# Altium schematic sheet BMD_RevB_B5_AMP.SchDoc: MPPC
size 401 x 291 mm; DocumentNumber: 2; SheetNumber: 5; SheetTotal: 6
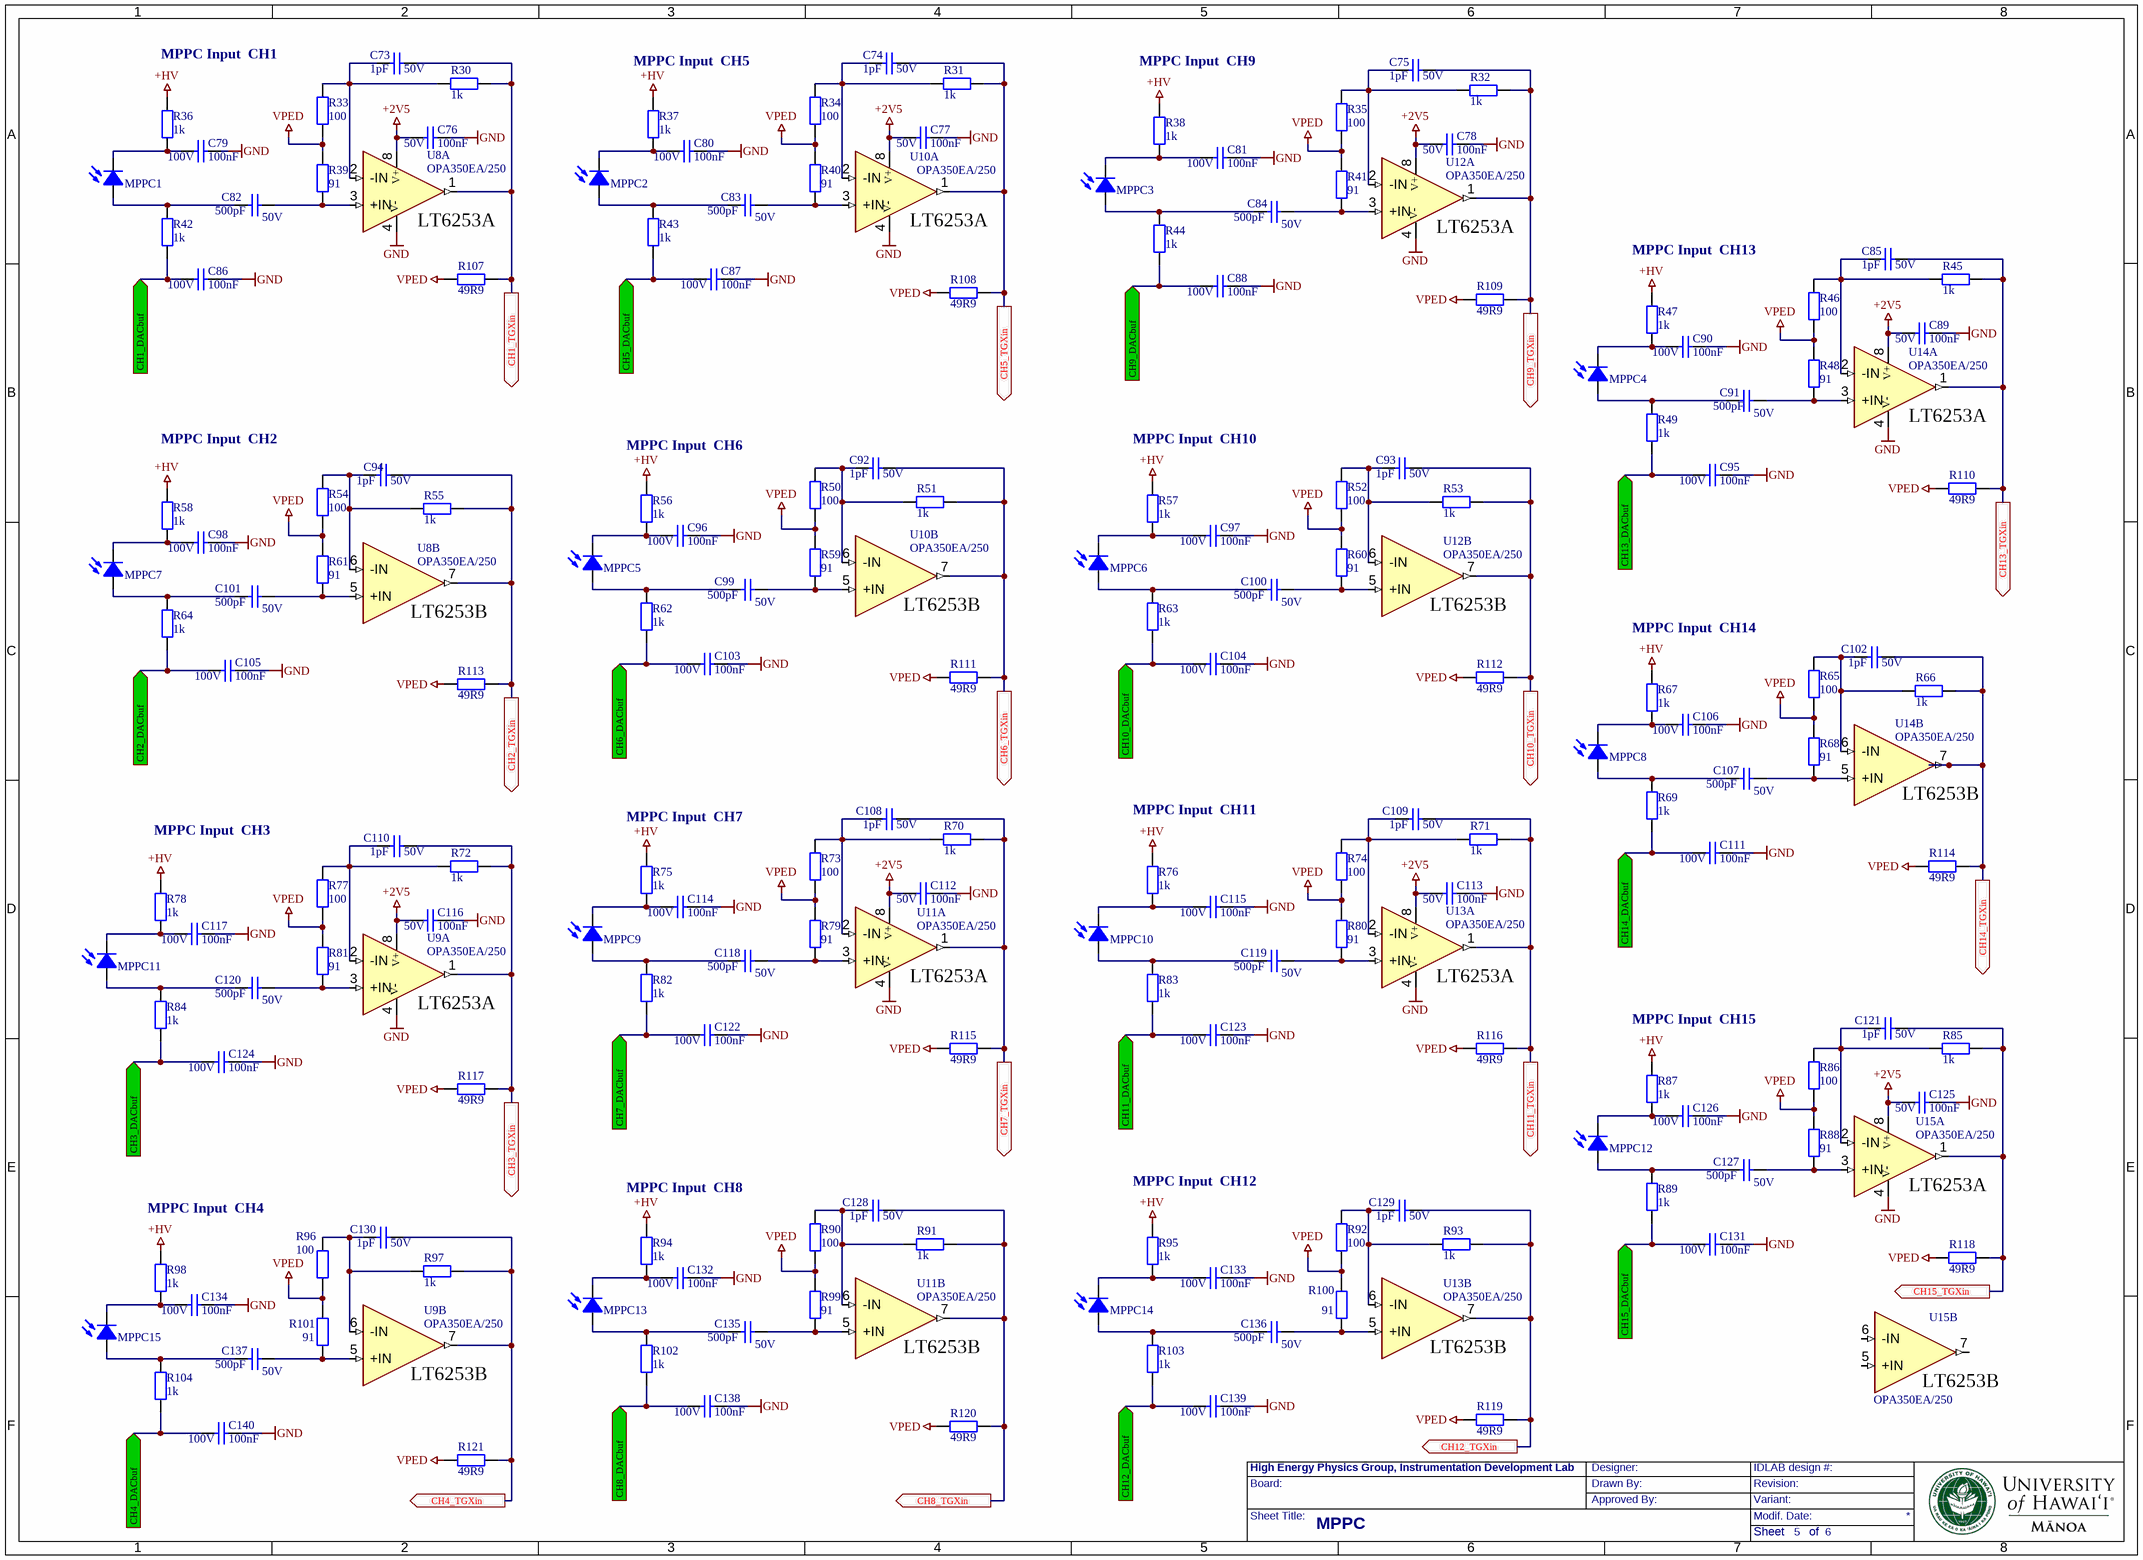
[diagram p0: BMD_RevB_B5_AMP.SchDoc]

## Parts
C73  1pF  Voltage rating: 50V  [CC0603RF1R]
C74  1pF  Voltage rating: 50V  [CC0603RF1R]
C75  1pF  Voltage rating: 50V  [CC0603RF1R]
C76  100nF  Voltage rating: 50V  [CC0402N1R]
C77  100nF  Voltage rating: 50V  [CC0402N1R]
C78  100nF  Voltage rating: 50V  [CC0402N1R]
C79  100nF  Voltage rating: 100V  [RC0603N1R]
C80  100nF  Voltage rating: 100V  [RC0603N1R]
C81  100nF  Voltage rating: 100V  [RC0603N1R]
C82  500pF  Voltage rating: 50V  [CC0603RF1R]
C83  500pF  Voltage rating: 50V  [CC0603RF1R]
C84  500pF  Voltage rating: 50V  [CC0603RF1R]
C85  1pF  Voltage rating: 50V  [CC0603RF1R]
C86  100nF  Voltage rating: 100V  [RC0603N1R]
C87  100nF  Voltage rating: 100V  [RC0603N1R]
C88  100nF  Voltage rating: 100V  [RC0603N1R]
C89  100nF  Voltage rating: 50V  [CC0402N1R]
C90  100nF  Voltage rating: 100V  [RC0603N1R]
C91  500pF  Voltage rating: 50V  [CC0603RF1R]
C92  1pF  Voltage rating: 50V  [CC0603RF1R]
C93  1pF  Voltage rating: 50V  [CC0603RF1R]
C94  1pF  Voltage rating: 50V  [CC0603RF1R]
C95  100nF  Voltage rating: 100V  [RC0603N1R]
C96  100nF  Voltage rating: 100V  [RC0603N1R]
C97  100nF  Voltage rating: 100V  [RC0603N1R]
C98  100nF  Voltage rating: 100V  [RC0603N1R]
C99  500pF  Voltage rating: 50V  [CC0603RF1R]
C100  500pF  Voltage rating: 50V  [CC0603RF1R]
C101  500pF  Voltage rating: 50V  [CC0603RF1R]
C102  1pF  Voltage rating: 50V  [CC0603RF1R]
C103  100nF  Voltage rating: 100V  [RC0603N1R]
C104  100nF  Voltage rating: 100V  [RC0603N1R]
C105  100nF  Voltage rating: 100V  [RC0603N1R]
C106  100nF  Voltage rating: 100V  [RC0603N1R]
C107  500pF  Voltage rating: 50V  [CC0603RF1R]
C108  1pF  Voltage rating: 50V  [CC0603RF1R]
C109  1pF  Voltage rating: 50V  [CC0603RF1R]
C110  1pF  Voltage rating: 50V  [CC0603RF1R]
C111  100nF  Voltage rating: 100V  [RC0603N1R]
C112  100nF  Voltage rating: 50V  [CC0402N1R]
C113  100nF  Voltage rating: 50V  [CC0402N1R]
C114  100nF  Voltage rating: 100V  [RC0603N1R]
C115  100nF  Voltage rating: 100V  [RC0603N1R]
C116  100nF  Voltage rating: 50V  [CC0402N1R]
C117  100nF  Voltage rating: 100V  [RC0603N1R]
C118  500pF  Voltage rating: 50V  [CC0603RF1R]
C119  500pF  Voltage rating: 50V  [CC0603RF1R]
C120  500pF  Voltage rating: 50V  [CC0603RF1R]
C121  1pF  Voltage rating: 50V  [CC0603RF1R]
C122  100nF  Voltage rating: 100V  [RC0603N1R]
C123  100nF  Voltage rating: 100V  [RC0603N1R]
C124  100nF  Voltage rating: 100V  [RC0603N1R]
C125  100nF  Voltage rating: 50V  [CC0402N1R]
C126  100nF  Voltage rating: 100V  [RC0603N1R]
C127  500pF  Voltage rating: 50V  [CC0603RF1R]
C128  1pF  Voltage rating: 50V  [CC0603RF1R]
C129  1pF  Voltage rating: 50V  [CC0603RF1R]
C130  1pF  Voltage rating: 50V  [CC0603RF1R]
C131  100nF  Voltage rating: 100V  [RC0603N1R]
C132  100nF  Voltage rating: 100V  [RC0603N1R]
C133  100nF  Voltage rating: 100V  [RC0603N1R]
C134  100nF  Voltage rating: 100V  [RC0603N1R]
C135  500pF  Voltage rating: 50V  [CC0603RF1R]
C136  500pF  Voltage rating: 50V  [CC0603RF1R]
C137  500pF  Voltage rating: 50V  [CC0603RF1R]
C138  100nF  Voltage rating: 100V  [RC0603N1R]
C139  100nF  Voltage rating: 100V  [RC0603N1R]
C140  100nF  Voltage rating: 100V  [RC0603N1R]
MPPC1  MPPC  [MPPC S12572-050P]  (value not drawn)
MPPC2  MPPC  [MPPC S12572-050P]  (value not drawn)
MPPC3  MPPC  [MPPC S12572-050P]  (value not drawn)
MPPC4  MPPC  [MPPC S12572-050P]  (value not drawn)
MPPC5  MPPC  [MPPC S12572-050P]  (value not drawn)
MPPC6  MPPC  [MPPC S12572-050P]  (value not drawn)
MPPC7  MPPC  [MPPC S12572-050P]  (value not drawn)
MPPC8  MPPC  [MPPC S12572-050P]  (value not drawn)
MPPC9  MPPC  [MPPC S12572-050P]  (value not drawn)
MPPC10  MPPC  [MPPC S12572-050P]  (value not drawn)
MPPC11  MPPC  [MPPC S12572-050P]  (value not drawn)
MPPC12  MPPC  [MPPC S12572-050P]  (value not drawn)
MPPC13  MPPC  [MPPC S12572-050P]  (value not drawn)
MPPC14  MPPC  [MPPC S12572-050P]  (value not drawn)
MPPC15  MPPC  [MPPC S12572-050P]  (value not drawn)
R30  1k  [RC0603N1R]
R31  1k  [RC0603N1R]
R32  1k  [RC0603N1R]
R33  100  [RC0603N1R]
R34  100  [RC0603N1R]
R35  100  [RC0603N1R]
R36  1k  [RC0805N1R]
R37  1k  [RC0805N1R]
R38  1k  [RC0805N1R]
R39  91  [RC0603N1R]
R40  91  [RC0603N1R]
R41  91  [RC0603N1R]
R42  1k  [RC0603N1R]
R43  1k  [RC0603N1R]
R44  1k  [RC0603N1R]
R45  1k  [RC0603N1R]
R46  100  [RC0603N1R]
R47  1k  [RC0805N1R]
R48  91  [RC0603N1R]
R49  1k  [RC0603N1R]
R50  100  [RC0603N1R]
R51  1k  [RC0603N1R]
R52  100  [RC0603N1R]
R53  1k  [RC0603N1R]
R54  100  [RC0603N1R]
R55  1k  [RC0603N1R]
R56  1k  [RC0805N1R]
R57  1k  [RC0805N1R]
R58  1k  [RC0805N1R]
R59  91  [RC0603N1R]
R60  91  [RC0603N1R]
R61  91  [RC0603N1R]
R62  1k  [RC0603N1R]
R63  1k  [RC0603N1R]
R64  1k  [RC0603N1R]
R65  100  [RC0603N1R]
R66  1k  [RC0603N1R]
R67  1k  [RC0805N1R]
R68  91  [RC0603N1R]
R69  1k  [RC0603N1R]
R70  1k  [RC0603N1R]
R71  1k  [RC0603N1R]
R72  1k  [RC0603N1R]
R73  100  [RC0603N1R]
R74  100  [RC0603N1R]
R75  1k  [RC0805N1R]
R76  1k  [RC0805N1R]
R77  100  [RC0603N1R]
R78  1k  [RC0805N1R]
R79  91  [RC0603N1R]
R80  91  [RC0603N1R]
R81  91  [RC0603N1R]
R82  1k  [RC0603N1R]
R83  1k  [RC0603N1R]
R84  1k  [RC0603N1R]
R85  1k  [RC0603N1R]
R86  100  [RC0603N1R]
R87  1k  [RC0805N1R]
R88  91  [RC0603N1R]
R89  1k  [RC0603N1R]
R90  100  [RC0603N1R]
R91  1k  [RC0603N1R]
R92  100  [RC0603N1R]
R93  1k  [RC0603N1R]
R94  1k  [RC0805N1R]
R95  1k  [RC0805N1R]
R96  100  [RC0603N1R]
R97  1k  [RC0603N1R]
R98  1k  [RC0805N1R]
R99  91  [RC0603N1R]
R100  91  [RC0603N1R]
R101  91  [RC0603N1R]
R102  1k  [RC0603N1R]
R103  1k  [RC0603N1R]
R104  1k  [RC0603N1R]
R107  49R9  [RC0603N1R]
R108  49R9  [RC0603N1R]
R109  49R9  [RC0603N1R]
R110  49R9  [RC0603N1R]
R111  49R9  [RC0603N1R]
R112  49R9  [RC0603N1R]
R113  49R9  [RC0603N1R]
R114  49R9  [RC0603N1R]
R115  49R9  [RC0603N1R]
R116  49R9  [RC0603N1R]
R117  49R9  [RC0603N1R]
R118  49R9  [RC0603N1R]
R119  49R9  [RC0603N1R]
R120  49R9  [RC0603N1R]
R121  49R9  [RC0603N1R]
U8  OPA350EA/250  [MSOP8N]  (parts A,B of 2)
U9  OPA350EA/250  [MSOP8N]  (parts A,B of 2)
U10  OPA350EA/250  [MSOP8N]  (parts A,B of 2)
U11  OPA350EA/250  [MSOP8N]  (parts A,B of 2)
U12  OPA350EA/250  [MSOP8N]  (parts A,B of 2)
U13  OPA350EA/250  [MSOP8N]  (parts A,B of 2)
U14  OPA350EA/250  [MSOP8N]  (parts A,B of 2)
U15  OPA350EA/250  [MSOP8N]  (parts A,B of 2)

## Ports
CH1_DACbuf (in), CH1_TGXin (out), CH2_DACbuf (in), CH2_TGXin (out), CH3_DACbuf (in), CH3_TGXin (out), CH4_DACbuf (in), CH4_TGXin (out), CH5_DACbuf (in), CH5_TGXin (out), CH6_DACbuf (in), CH6_TGXin (out), CH7_DACbuf (in), CH7_TGXin (out), CH8_DACbuf (in), CH8_TGXin (out), CH9_DACbuf (in), CH9_TGXin (out), CH10_DACbuf (in), CH10_TGXin (out), CH11_DACbuf (in), CH11_TGXin (out), CH12_DACbuf (in), CH12_TGXin (out), CH13_DACbuf (in), CH13_TGXin (out), CH14_DACbuf (in), CH14_TGXin (out), CH15_DACbuf (in), CH15_TGXin (out)

## Nets
+2V5: C76.2 C77.2 C78.2 C89.2 C112.2 C113.2 C116.2 C125.2 U8.8(V+) U9.8(V+) U10.8(V+) U11.8(V+) U12.8(V+) U13.8(V+) U14.8(V+) U15.8(V+)
+HV: R36.1 R37.1 R38.1 R47.1 R56.1 R57.1 R58.1 R67.1 R75.1 R76.1 R78.1 R87.1 R94.1 R95.1 R98.1
GND: C76.1 C77.1 C78.1 C79.2 C80.2 C81.2 C86.2 C87.2 C88.2 C89.1 C90.2 C95.2 C96.2 C97.2 C98.2 C103.2 C104.2 C105.2 C106.2 C111.2 C112.1 C113.1 C114.2 C115.2 C116.1 C117.2 C122.2 C123.2 C124.2 C125.1 C126.2 C131.2 C132.2 C133.2 C134.2 C138.2 C139.2 C140.2 U8.4(V-) U9.4(V-) U10.4(V-) U11.4(V-) U12.4(V-) U13.4(V-) U14.4(V-) U15.4(V-)
VPED: R33.1 R34.1 R35.1 R39.1 R40.1 R41.1 R46.1 R48.1 R50.1 R52.1 R54.1 R59.2 R60.2 R61.2 R65.1 R68.2 R73.1 R74.1 R77.1 R79.1 R80.1 R81.1 R86.1 R88.1 R90.1 R92.1 R96.1 R99.2 R100.2 R101.2 R107.1 R108.1 R109.1 R110.1 R111.1 R112.1 R113.1 R114.1 R115.1 R116.1 R117.1 R118.1 R119.1 R120.1 R121.1
CH1_DACbuf: C86.1 R42.1 ; port CH1_DACbuf
CH1_TGXin: C73.2 R30.2 R107.2 U8.1(OUT) ; port CH1_TGXin
CH2_DACbuf: C105.1 R64.1 ; port CH2_DACbuf
CH2_TGXin: C94.2 R55.2 R113.2 U8.7(OUT) ; port CH2_TGXin
CH3_DACbuf: C124.1 R84.1 ; port CH3_DACbuf
CH3_TGXin: C110.2 R72.2 R117.2 U9.1(OUT) ; port CH3_TGXin
CH4_DACbuf: C140.1 R104.1 ; port CH4_DACbuf
CH4_TGXin: C130.2 R97.2 R121.2 U9.7(OUT) ; port CH4_TGXin
CH5_DACbuf: C87.1 R43.1 ; port CH5_DACbuf
CH5_TGXin: C74.2 R31.2 R108.2 U10.1(OUT) ; port CH5_TGXin
CH6_DACbuf: C103.1 R62.1 ; port CH6_DACbuf
CH6_TGXin: C92.2 R51.2 R111.2 U10.7(OUT) ; port CH6_TGXin
CH7_DACbuf: C122.1 R82.1 ; port CH7_DACbuf
CH7_TGXin: C108.2 R70.2 R115.2 U11.1(OUT) ; port CH7_TGXin
CH8_DACbuf: C138.1 R102.1 ; port CH8_DACbuf
CH8_TGXin: C128.2 R91.2 R120.2 U11.7(OUT) ; port CH8_TGXin
CH9_DACbuf: C88.1 R44.1 ; port CH9_DACbuf
CH9_TGXin: C75.2 R32.2 R109.2 U12.1(OUT) ; port CH9_TGXin
CH10_DACbuf: C104.1 R63.1 ; port CH10_DACbuf
CH10_TGXin: C93.2 R53.2 R112.2 U12.7(OUT) ; port CH10_TGXin
CH11_DACbuf: C123.1 R83.1 ; port CH11_DACbuf
CH11_TGXin: C109.2 R71.2 R116.2 U13.1(OUT) ; port CH11_TGXin
CH12_DACbuf: C139.1 R103.1 ; port CH12_DACbuf
CH12_TGXin: C129.2 R93.2 R119.2 U13.7(OUT) ; port CH12_TGXin
CH13_DACbuf: C95.1 R49.1 ; port CH13_DACbuf
CH13_TGXin: C85.2 R45.2 R110.2 U14.1(OUT) ; port CH13_TGXin
CH14_DACbuf: C111.1 R69.1 ; port CH14_DACbuf
CH14_TGXin: C102.2 R66.2 R114.2 U14.7(OUT) ; port CH14_TGXin
CH15_DACbuf: C131.1 R89.1 ; port CH15_DACbuf
CH15_TGXin: C121.2 R85.2 R118.2 U15.1(OUT) ; port CH15_TGXin
NetC73_1: C73.1 R30.1 R33.2 U8.2(-IN)
NetC74_1: C74.1 R31.1 R34.2 U10.2(-IN)
NetC75_1: C75.1 R32.1 R35.2 U12.2(-IN)
NetC79_1: C79.1 MPPC1.2(C) R36.2
NetC80_1: C80.1 MPPC2.2(C) R37.2
NetC81_1: C81.1 MPPC3.2(C) R38.2
NetC82_1: C82.1 MPPC1.1(A) R42.2
NetC82_2: C82.2 R39.2 U8.3(+IN)
NetC83_1: C83.1 MPPC2.1(A) R43.2
NetC83_2: C83.2 R40.2 U10.3(+IN)
NetC84_1: C84.1 MPPC3.1(A) R44.2
NetC84_2: C84.2 R41.2 U12.3(+IN)
NetC85_1: C85.1 R45.1 R46.2 U14.2(-IN)
NetC90_1: C90.1 MPPC4.2(C) R47.2
NetC91_1: C91.1 MPPC4.1(A) R49.2
NetC91_2: C91.2 R48.2 U14.3(+IN)
NetC92_1: C92.1 R50.2 R51.1 U10.6(-IN)
NetC93_1: C93.1 R52.2 R53.1 U12.6(-IN)
NetC94_1: C94.1 R54.2 R55.1 U8.6(-IN)
NetC96_1: C96.1 MPPC5.2(C) R56.2
NetC97_1: C97.1 MPPC6.2(C) R57.2
NetC98_1: C98.1 MPPC7.2(C) R58.2
NetC99_1: C99.1 MPPC5.1(A) R62.2
NetC99_2: C99.2 R59.1 U10.5(+IN)
NetC100_1: C100.1 MPPC6.1(A) R63.2
NetC100_2: C100.2 R60.1 U12.5(+IN)
NetC101_1: C101.1 MPPC7.1(A) R64.2
NetC101_2: C101.2 R61.1 U8.5(+IN)
NetC102_1: C102.1 R65.2 R66.1 U14.6(-IN)
NetC106_1: C106.1 MPPC8.2(C) R67.2
NetC107_1: C107.1 MPPC8.1(A) R69.2
NetC107_2: C107.2 R68.1 U14.5(+IN)
NetC108_1: C108.1 R70.1 R73.2 U11.2(-IN)
NetC109_1: C109.1 R71.1 R74.2 U13.2(-IN)
NetC110_1: C110.1 R72.1 R77.2 U9.2(-IN)
NetC114_1: C114.1 MPPC9.2(C) R75.2
NetC115_1: C115.1 MPPC10.2(C) R76.2
NetC117_1: C117.1 MPPC11.2(C) R78.2
NetC118_1: C118.1 MPPC9.1(A) R82.2
NetC118_2: C118.2 R79.2 U11.3(+IN)
NetC119_1: C119.1 MPPC10.1(A) R83.2
NetC119_2: C119.2 R80.2 U13.3(+IN)
NetC120_1: C120.1 MPPC11.1(A) R84.2
NetC120_2: C120.2 R81.2 U9.3(+IN)
NetC121_1: C121.1 R85.1 R86.2 U15.2(-IN)
NetC126_1: C126.1 MPPC12.2(C) R87.2
NetC127_1: C127.1 MPPC12.1(A) R89.2
NetC127_2: C127.2 R88.2 U15.3(+IN)
NetC128_1: C128.1 R90.2 R91.1 U11.6(-IN)
NetC129_1: C129.1 R92.2 R93.1 U13.6(-IN)
NetC130_1: C130.1 R96.2 R97.1 U9.6(-IN)
NetC132_1: C132.1 MPPC13.2(C) R94.2
NetC133_1: C133.1 MPPC14.2(C) R95.2
NetC134_1: C134.1 MPPC15.2(C) R98.2
NetC135_1: C135.1 MPPC13.1(A) R102.2
NetC135_2: C135.2 R99.1 U11.5(+IN)
NetC136_1: C136.1 MPPC14.1(A) R103.2
NetC136_2: C136.2 R100.1 U13.5(+IN)
NetC137_1: C137.1 MPPC15.1(A) R104.2
NetC137_2: C137.2 R101.1 U9.5(+IN)

Not connected (* = marked no-connect by the designer): U15 5(+IN) 6(-IN) 7(OUT)

## Notes on the sheet
- MPPC Input  CH1
- (near R37) MPPC Input  CH5
- (near R38) MPPC Input  CH9
- MPPC Input  CH13
- MPPC Input  CH2
- (near R56) MPPC Input  CH6
- (near R57) MPPC Input  CH10
- MPPC Input  CH14
- MPPC Input  CH3
- (near R75) MPPC Input  CH7
- (near R76) MPPC Input  CH11
- MPPC Input  CH15
- MPPC Input  CH4
- (near R94) MPPC Input  CH8
- (near R95) MPPC Input  CH12
- Board:
- High Energy Physics Group, Instrumentation Development Lab
- Drawn By:
- Designer:
- Approved By:
- Revision:
- IDLAB design #:
- Variant:
- Sheet Title:
- Modif. Date:
- Sheet       of
- (in symbol OPAMP_LT6253CMS8, part A) LT6253A
- (in symbol OPAMP_LT6253CMS8, part B) LT6253B

## Library data of the parts
C73-C75 C85 C92-C94 C102 C108-C110 C121 C128-C130 = CAPCC0603_1P_50VNPO: 100pF 50V Ceramic Capacitor C0G, NP0 0603; Manufacturer: AVX Corporation; Manufacturer No: ML03511R0BAT2A; Tech: SMDR; Package: Cap Chip 0603; Supplier 1: Digi-Key; Supplier Part Number 1: 478-6707-6-ND
C76-C78 C89 C112 C113 C116 C125 = CAPCC0402_100N_50VX7R: 0.10µF 50V Ceramic Capacitor X7R 0402; Manufacturer: TDK; Manufacturer No: C1005X7R1H104K050BB; Tech: SMDR; Package: Cap Chip 0402; Supplier 1: Digi-Key; Supplier Part Number 1: 445-5932-1-ND
C79-C81 C86-C88 C90 C95-C98 C103-C106 C111 C114 C115 C117 C122-C124 C126 C131-C134 C138-C140 = CAPCC0603_100N100VX7R: 0.10µF 100V Ceramic Capacitor X7R 0603; Manufacturer: Yageo; Manufacturer No: CC0603KRX7R0BB104; Tech: SMDR; Supplier 1: Digi-Key; Supplier Part Number 1: 311-1523-1-ND
C82-C84 C91 C99-C101 C107 C118-C120 C127 C135-C137 = CAPCC0603_500P_50VNPO: 100pF 50V Ceramic Capacitor C0G, NP0 0603; Manufacturer: KEMET; Manufacturer No: C0603C511J5GACTU; Tech: SMDR; Package: Cap Chip 0603; Supplier 1: Digi-Key; Supplier Part Number 1: 399-9102-6-ND
MPPC1-MPPC15 = MPPC: 3x3mm Multi-Pixel photon counter; Manufacturer: HAMAMATSU; Manufacturer No: S12572-050; Tech: SMD_manual; Package: S12572-050P; Supplier 1: HAMAMATSU; Supplier Part Number 1: S12572-050; Supplier Order Qty 1: 1; Supplier Unit Price 1: 0
R30-R32 R42-R45 R49 R51 R53 R55 R62-R64 R66 R69-R72 R82-R85 R89 R91 R93 R97 R102-R104 = RES0603-1K-1%100PPM: RES SMD 1K OHM 1% 1/10W 0603; Manufacturer: Yageo; Manufacturer No: RC0603FR-071KL; Tech: SMDR; Package: Res Chip 0603; Supplier 1: Digi-Key; Supplier Part Number 1: 311-1.00KHRCT-ND
R33-R35 R46 R50 R52 R54 R65 R73 R74 R77 R86 R90 R92 R96 = RES0603-100-1%100PPM: RES SMD 1K OHM 1% 1/10W 0603; Manufacturer: Stackpole Electronics Inc.; Manufacturer No: RNCP0603FTD100R; Tech: SMDR; Package: Res Chip 0603; Supplier 1: Digi-Key; Supplier Part Number 1: RNCP0603FTD100RDKR-ND
R36-R38 R47 R56-R58 R67 R75 R76 R78 R87 R94 R95 R98 = RES0805-1K-1%100PPM Precision: RES SMD 1K OHM 1% 1/4W 0805; Manufacturer: Bourns Inc.; Manufacturer No: CRS0805-FX-1001ELF; Tech: SMDR; Package: Res Chip 0805; Supplier 1: Digi-Key; Supplier Part Number 1: CRS0805-FX-1001ELFCT-ND
R39-R41 R48 R59-R61 R68 R79-R81 R88 R99-R101 = RES0603-91-1%100PPM: RES SMD 91 OHM 1% 1/10W 0603; Manufacturer: Yageo; Manufacturer No: RC0603FR-0791RL; Tech: SMDR; Package: Res Chip 0603; Supplier 1: Digi-Key; Supplier Part Number 1: 311-91.0HRDKR-ND
R107-R121 = RES0603-0-49.9R-1%100PPM: Chip Resistor 0603 100mW 1% 100ppm; Manufacturer: Panasonic; Manufacturer No: ERJ-3EKF49R9V; Tech: SMDR; Package: Res Chip 0603; Supplier 1: Digi-Key; Supplier Part Number 1: P49.9HDKR-ND; Supplier 2: Mouser; Supplier Part Number 2: 667-ERJ-3EKF49R9V; Supplier 3: Newark; Supplier Part Number 3: 65T8468
U8-U15 = OPAMP_LT6253CMS8: Single-Supply, Rail-to-Rail, 720MHZ; Manufacturer: Linear Technology/Analog Devices; Manufacturer No: LTC6253CMS8#PBF; Tech: SMDR; Package: MSOP8; Supplier 1: Digi-Key; Supplier Part Number 1: LTC6253CMS8#PBF-ND